# EAGLE design rev2 (EAGLE 9.3.0)
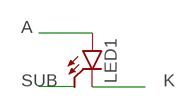
[diagram p0: schematic, sheet 1]

## Parts
LED1  MKRAWT-00-0000-  [MK-R]

## Nets
A: LED1.A
K: LED1.K(C)
SUB: LED1.SUB

## Library data of the parts
LED1 = parts-cree:MKRAWT-00-0000-

## Board
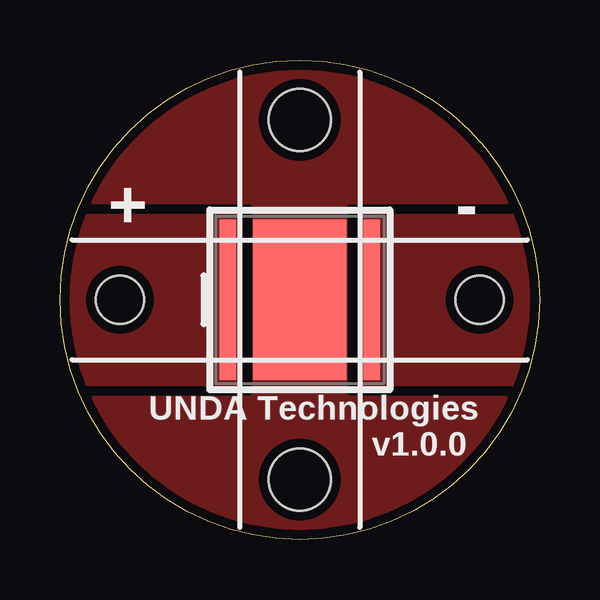
[diagram p1: board, top side]

Size 20 x 20 mm. Coordinates in mm from the lower left corner, seen from the top.
Outline: 0,10 arc-180 20,10 arc-180 0,10
Copper layers 1: Top 0.035mm
Design rules "default *": minimum track width 6mil, minimum drill 0.35mm, track to track 6mil, track to pad 6mil, pad to pad 6mil, via to via 6mil, smd to smd 6mil, copper to edge 0.1mm, drill to drill 6mil, minimum pad ring 10mil, minimum via ring 8mil, stop-mask expansion 4mil, vias tented up to drill 0mil, thermal gap 10mil
Holes 2.6 mm at 10,2.5 10,17.5
Holes 2 mm at 2.5,10 17.5,10

### Footprints (pad centres in the part's own frame; a part is rotated, then mirrored left to right if it is on the bottom)
MK-R = smd 0.7 x 6.7: A -3,0; K 3,0 | smd 3.9 x 6.7: SUB 0,0

### Placement (x,y rotation side)
LED1  10,10 0 top

### Tracks (layer width: path | path; a pad name or v marks a point on that pad's centre or on a via)
A
  pour Top (isolate 0.4, no thermals): -1,13.5 7.5,13.5 7.5,6.5 -1,6.5
K
  pour Top (isolate 0.4, no thermals): 12.5,13.5 21,13.5 21,6.5 12.5,6.5
SUB
  pour Top (isolate 0.4, rank 6, no thermals): 0,0 0,20 20,20 20,0

### Text on the board
tNames: + | - | UNDA Technologies | v1.0.0